# EAGLE schematic vm_mini_exp5 (EAGLE 6.4)

## Sheet 1 of 3
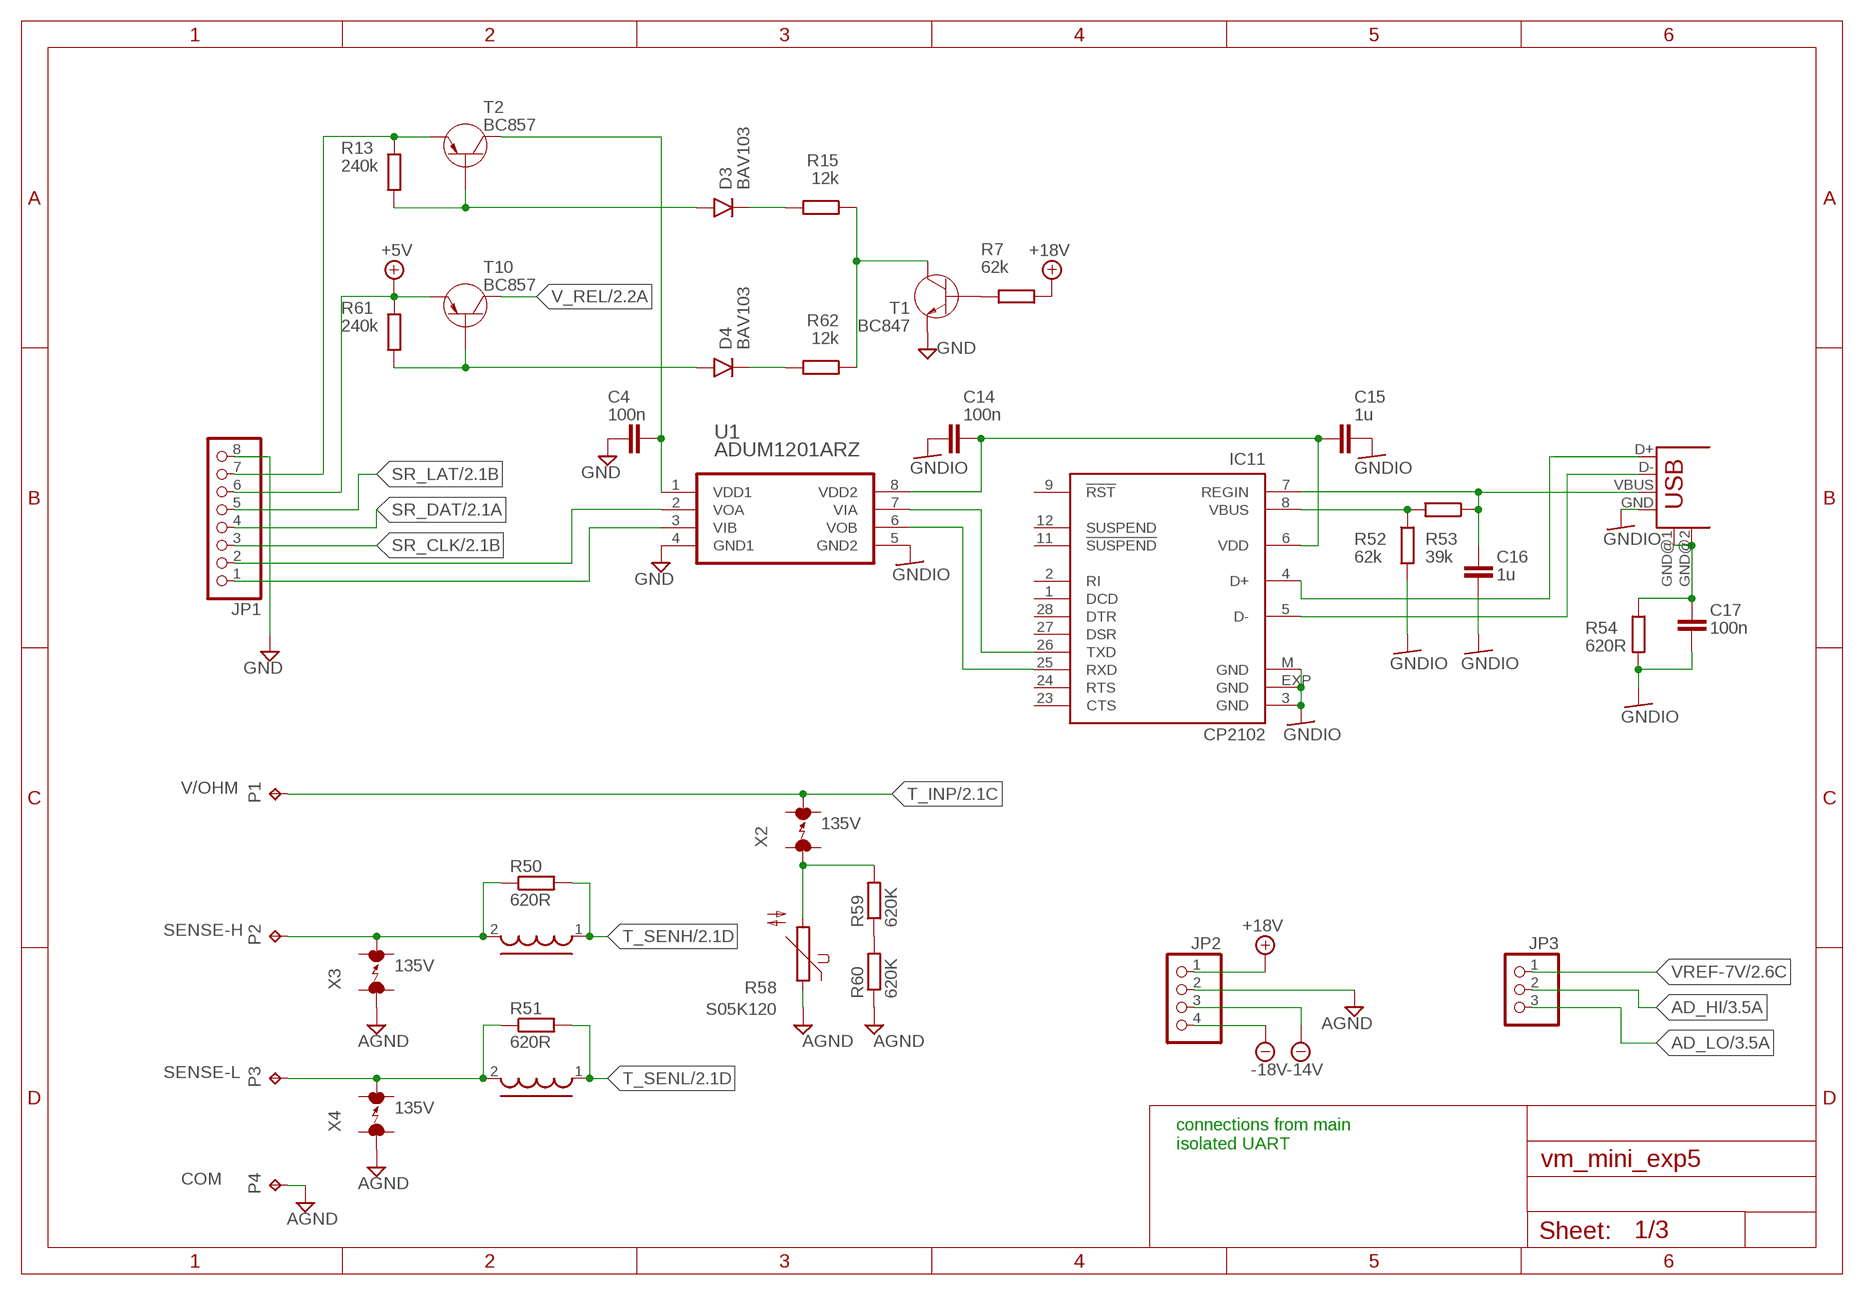
[diagram p0: schematic, sheet 1]

### Parts
C4  100n  C_0806  [R0805]
C14  100n  C_0806  [R0805]
C15  1u  C_0806  [R0805]
C16  1u  C_0806  [R0805]
C17  100n  C_0806  [R0805]
D3  BAV103  1N4148SOD  [SOD-80]
D4  BAV103  1N4148SOD  [SOD-80]
IC11  CP2102  [MLP28]
JP1  PINHD-1X08_2.54  [1X08]
JP2  PINHD-1X04_2.54  [1X04]
JP3  PINHD-1X03_2.54  [1X03]
P1  TPPAD1-17  [P1-17]
P2  TPPAD1-17  [P1-17]
P3  TPPAD1-17  [P1-17]
P4  TPPAD1-17  [P1-17]
R7  62k  RMMELF  [R_MINIMELF]
R13  240k  RMMELF  [R_MINIMELF]
R15  12k  RMMELF  [R_MINIMELF]
R50  620R  RMMELF  [R_MINIMELF]
R51  620R  RMMELF  [R_MINIMELF]
R52  62k  RMMELF  [R_MINIMELF]
R53  39k  RMMELF  [R_MINIMELF]
R54  620R  RMMELF  [R_MINIMELF]
R58  S05K120  S05K175  [S05K175]
R59  620K  RMMELF  [R_MINIMELF]
R60  620K  RMMELF  [R_MINIMELF]
R61  240k  RMMELF  [R_MINIMELF]
R62  12k  RMMELF  [R_MINIMELF]
T1  BC847  [SOT23]
T2  BC857  [SOT23]
T10  BC857  [SOT23]
U1  ADUM1201ARZ  [SOIC127P600X175-8N]
U$7  INDUCTOR_GEN1210  [1210]
U$8  INDUCTOR_GEN1210  [1210]
USB1  USB-B-H  [USB-B-H]
X2  135V  ARRESTER  [EPCOS_N81]
X3  135V  ARRESTER  [EPCOS_N81]
X4  135V  ARRESTER  [EPCOS_N81]

### Nets
+5V: JP1.6 R61.P$1 T10.2(C) ; also sheet 2
+18V: JP2.1 R7.P$2 ; also sheet 2,3
-14V: JP2.3 ; also sheet 2,3
-18V: JP2.4 ; also sheet 2
AD_HI: JP3.2 ; also sheet 3
AD_LO: JP3.3 ; also sheet 3
AGND: JP2.2 P4.TP R58.1 R60.P$1 X3.1 X4.1 ; also sheet 2,3
GND: C4.1 JP1.8 T1.2(E) U1.4(GND1) ; also sheet 2
GNDIO: C14.1 C15.2 C16.1 C17.1 IC11.3(GND) IC11.EXP(GND) IC11.M(GND) R52.P$2 R54.P$2 U1.5(GND2) USB1.GND
N$1: JP1.1 U1.3(VIB)
N$2: JP1.2 U1.2(VOA)
N$3: IC11.4(D+) USB1.D+
N$4: IC11.5(D-) USB1.D-
N$5: C16.2 IC11.7(REGIN) R53.P$1 USB1.VBUS
N$39: R58.2 R59.P$2 X2.1
N$50: IC11.26(TXD) U1.7(VIA)
N$51: IC11.25(RXD) U1.6(VOB)
N$52: C14.2 C15.1 IC11.6(VDD) U1.8(VDD2)
N$53: IC11.8(VBUS) R52.P$1 R53.P$2
N$56: C17.2 R54.P$1 USB1.GND@1(GND) USB1.GND@2(GND)
N$57: R15.P$1 R62.P$1 T1.3(C)
N$61: D3.A R13.P$2 T2.1(B)
N$62: D4.K R62.P$2
N$64: R7.P$1 T1.1(B)
N$66: R59.P$1 R60.P$2
N$98: P3.TP R51.P$1 U$8.2 X4.2
N$99: P2.TP R50.P$1 U$7.2 X3.2
N$102: JP1.7 R13.P$1 T2.2(C)
N$103: D4.A R61.P$2 T10.1(B)
N$106: C4.2 T2.3(E) U1.1(VDD1)
N$107: D3.K R15.P$2
SR_CLK: JP1.3 ; also sheet 2
SR_DAT: JP1.4 ; also sheet 2
SR_LAT: JP1.5 ; also sheet 2
T_INP: P1.TP X2.2 ; also sheet 2
T_SENH: R50.P$2 U$7.1 ; also sheet 2
T_SENL: R51.P$2 U$8.1 ; also sheet 2
V_REL: T10.3(E) ; also sheet 2
VREF-7V: JP3.1 ; also sheet 2,3
Unconnected: IC11.1(DCD) IC11.2(RI) IC11.9(!RST) IC11.11(!SUSPEND) IC11.12(SUSPEND) IC11.23(CTS) IC11.24(RTS) IC11.27(DSR) IC11.28(DTR)

### Notes on the sheet
- V/OHM
- SENSE-H
- SENSE-L
- connections from main
  isolated UART
- COM

## Sheet 2 of 3
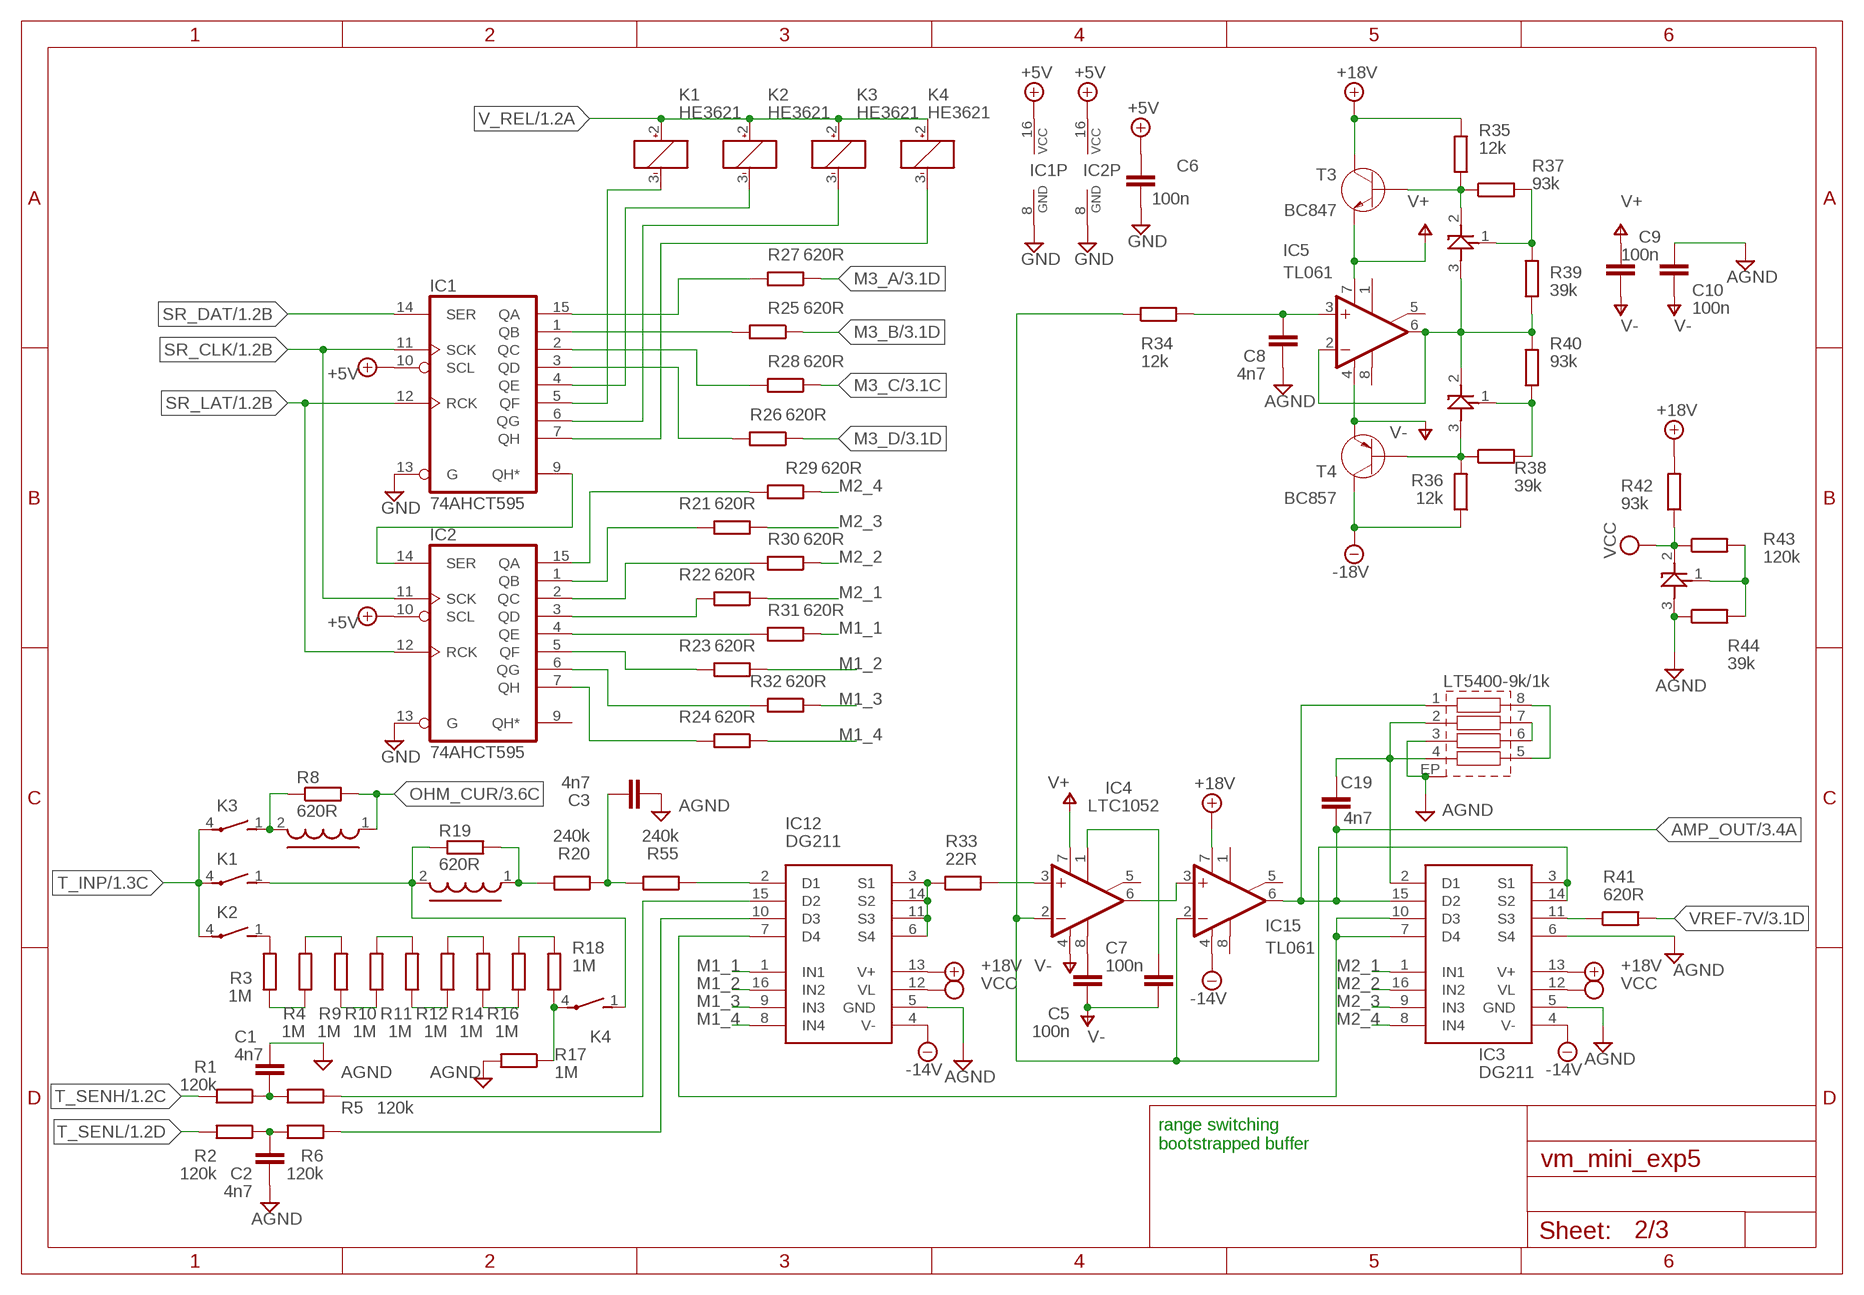
[diagram p1: schematic, sheet 2]

### Parts
C1  4n7  C-EU050-025X075  [C050-025X075]
C2  4n7  C-EU050-025X075  [C050-025X075]
C3  4n7  C-EU050-025X075  [C050-025X075]
C5  100n  C-EU050-045X075  [C050-045X075]
C6  100n  C_0806  [R0805]
C7  100n  C-EU050-045X075  [C050-045X075]
C8  4n7  C-EU050-025X075  [C050-025X075]
C9  100n  C_0806  [R0805]
C10  100n  C_0806  [R0805]
C19  4n7  C-EU050-025X075  [C050-025X075]
IC1  74AHCT595  74HCT595D  [SO16]
IC2  74AHCT595  74HCT595D  [SO16]
IC3  DG211  [SO-16]
IC4  LTC1052  TL071P  [DIL08]
IC5  TL061  TL071D  [SO08]
IC6  TL431_SOT23  [SOT23]
IC12  DG211  [SO-16]
IC13  TL431_SOT23  [SOT23]
IC14  TL431_SOT23  [SOT23]
IC15  TL061  TL071D  [SO08]
K1  HE3621  [HE3621]
K2  HE3621  [HE3621]
K3  HE3621  [HE3621]
K4  HE3621  [HE3621]
R1  120k  RMMELF  [R_MINIMELF]
R2  120k  RMMELF  [R_MINIMELF]
R3  1M  RMMELF  [R_MINIMELF]
R4  1M  RMMELF  [R_MINIMELF]
R5  120k  RMMELF  [R_MINIMELF]
R6  120k  RMMELF  [R_MINIMELF]
R8  620R  RMMELF  [R_MINIMELF]
R9  1M  RMMELF  [R_MINIMELF]
R10  1M  RMMELF  [R_MINIMELF]
R11  1M  RMMELF  [R_MINIMELF]
R12  1M  RMMELF  [R_MINIMELF]
R14  1M  RMMELF  [R_MINIMELF]
R16  1M  RMMELF  [R_MINIMELF]
R17  1M  RMMELF  [R_MINIMELF]
R18  1M  RMMELF  [R_MINIMELF]
R19  620R  RMMELF  [R_MINIMELF]
R20  240k  RMMELF  [R_MINIMELF]
R21  620R  RMMELF  [R_MINIMELF]
R22  620R  RMMELF  [R_MINIMELF]
R23  620R  RMMELF  [R_MINIMELF]
R24  620R  RMMELF  [R_MINIMELF]
R25  620R  RMMELF  [R_MINIMELF]
R26  620R  RMMELF  [R_MINIMELF]
R27  620R  RMMELF  [R_MINIMELF]
R28  620R  RMMELF  [R_MINIMELF]
R29  620R  RMMELF  [R_MINIMELF]
R30  620R  RMMELF  [R_MINIMELF]
R31  620R  RMMELF  [R_MINIMELF]
R32  620R  RMMELF  [R_MINIMELF]
R33  22R  RMMELF  [R_MINIMELF]
R34  12k  RMMELF  [R_MINIMELF]
R35  12k  RMMELF  [R_MINIMELF]
R36  12k  RMMELF  [R_MINIMELF]
R37  93k  RMMELF  [R_MINIMELF]
R38  39k  RMMELF  [R_MINIMELF]
R39  39k  RMMELF  [R_MINIMELF]
R40  93k  RMMELF  [R_MINIMELF]
R41  620R  RMMELF  [R_MINIMELF]
R42  93k  RMMELF  [R_MINIMELF]
R43  120k  RMMELF  [R_MINIMELF]
R44  39k  RMMELF  [R_MINIMELF]
R55  240k  RMMELF  [R_MINIMELF]
RN3  LT5400  [MSOP8-EP]
T3  BC847  [SOT23]
T4  BC857  [SOT23]
U$1  INDUCTOR_GEN1210  [1210]
U$2  INDUCTOR_GEN1210  [1210]

### Nets
+5V: C6.1 IC1.10(SCL) IC1.16(VCC) IC2.10(SCL) IC2.16(VCC) ; also sheet 1
+18V: IC3.13(V+) IC12.13(V+) IC15.7(V+) R35.P$2 R42.P$2 T3.3(C) ; also sheet 1,3
-14V: IC3.4(V-) IC12.4(V-) IC15.4(V-) ; also sheet 1,3
-18V: R36.P$1 T4.3(E) ; also sheet 1
AGND: C1.1 C2.1 C3.1 C8.1 C10.1 IC3.5(GND) IC3.6(S4) IC6.3(A) IC12.5(GND) R17.P$2 R44.P$1 RN3.3(R3A) RN3.EP(SH) ; also sheet 1,3
AGND1: IC14.3(A) R36.P$2 R38.P$1 T4.1(B)
AMP_OUT: C19.1 IC3.15(D2) IC15.6(OUT) RN3.1(R1A) ; also sheet 3
GND: C6.2 IC1.8(GND) IC1.13(G) IC2.8(GND) IC2.13(G) ; also sheet 1
M1_1: IC12.1(IN1) R31.P$1
M1_2: IC12.16(IN2) R23.P$1
M1_3: IC12.9(IN3) R32.P$1
M1_4: IC12.8(IN4) R24.P$1
M2_1: IC3.1(IN1) R22.P$1
M2_2: IC3.16(IN2) R30.P$1
M2_3: IC3.9(IN3) R21.P$1
M2_4: IC3.8(IN4) R29.P$1
M3_A: R27.P$1 ; also sheet 3
M3_B: R25.P$1 ; also sheet 3
M3_C: R28.P$1 ; also sheet 3
M3_D: R26.P$1 ; also sheet 3
N$6: IC3.7(D4) IC3.10(D3) IC12.7(D4)
N$7: RN3.5(R4B) RN3.8(R1B)
N$8: C19.2 IC3.2(D1) RN3.2(R2A) RN3.4(R4A)
N$9: RN3.6(R3B) RN3.7(R2B)
N$15: R3.P$1 R4.P$1
N$16: IC12.3(S1) IC12.6(S4) IC12.11(S3) IC12.14(S2) R33.P$1
N$17: R4.P$2 R9.P$2
N$18: R9.P$1 R10.P$1
N$19: R10.P$2 R11.P$2
N$20: R11.P$1 R12.P$1
N$21: R12.P$2 R14.P$2
N$22: R14.P$1 R16.P$1
N$23: R16.P$2 R18.P$2
N$24: K4.4(2:P) R17.P$1 R18.P$1
N$25: K2.1(2:S) R3.P$2
N$26: IC1.5(QF) K1.3(1:-)
N$27: R19.P$2 R20.P$2 U$2.1
N$28: IC1.4(QE) K2.3(1:-)
N$29: IC1.6(QG) K3.3(1:-)
N$30: C3.2 R20.P$1 R55.P$2
N$31: IC4.3(+IN) R33.P$2
N$32: IC1.7(QH) K4.3(1:-)
N$33: C1.2 R1.P$1 R5.P$2
N$34: IC5.2(-IN) IC5.6(OUT) IC13.3(A) IC14.2(C) R39.P$1 R40.P$1
N$35: C5.2 IC4.8(OPT)
N$36: C7.2 IC4.1(ON1)
N$37: C2.2 R2.P$1 R6.P$2
N$38: IC12.15(D2) R5.P$1
N$40: C8.2 IC5.3(+IN) R34.P$2
N$41: IC12.10(D3) R6.P$1
N$44: IC1.9(QH*) IC2.14(SER)
N$46: IC1.15(QA) R27.P$2
N$47: IC1.1(QB) R25.P$2
N$48: IC1.2(QC) R28.P$2
N$49: IC1.3(QD) R26.P$2
N$54: IC2.15(QA) R29.P$2
N$55: IC2.1(QB) R21.P$2
N$58: IC3.3(S1) IC3.14(S2) IC4.2(-IN) IC15.2(-IN) R34.P$1
N$59: IC2.2(QC) R30.P$2
N$60: IC2.3(QD) R22.P$2
N$63: IC2.4(QE) R31.P$2
N$65: IC12.2(D1) R55.P$1
N$67: IC3.11(S3) R41.P$1
N$68: IC2.7(QH) R24.P$2
N$69: IC2.6(QG) R32.P$2
N$70: IC2.5(QF) R23.P$2
N$82: IC13.2(C) R35.P$1 R37.P$1 T3.1(B)
N$83: IC13.1(R) R37.P$2 R39.P$2
N$91: IC6.1(R) R43.P$2 R44.P$2
N$92: IC14.1(R) R38.P$2 R40.P$2
N$100: K1.1(2:S) K4.1(2:S) R19.P$1 U$2.2
N$101: K3.1(2:S) R8.P$1 U$1.2
N$104: IC4.6(OUT) IC15.3(+IN)
OHM_CUR: R8.P$2 U$1.1 ; also sheet 3
SR_CLK: IC1.11(SCK) IC2.11(SCK) ; also sheet 1
SR_DAT: IC1.14(SER) ; also sheet 1
SR_LAT: IC1.12(RCK) IC2.12(RCK) ; also sheet 1
T_INP: K1.4(2:P) K2.4(2:P) K3.4(2:P) ; also sheet 1
T_SENH: R1.P$2 ; also sheet 1
T_SENL: R2.P$2 ; also sheet 1
V+: C9.1 IC4.7(V+) IC5.7(V+) T3.2(E)
V-: C5.1 C7.1 C9.2 C10.2 IC4.4(V-) IC5.4(V-) T4.2(C)
V_REL: K1.2(1:+) K2.2(1:+) K3.2(1:+) K4.2(1:+) ; also sheet 1
VCC: IC3.12(VL) IC6.2(C) IC12.12(VL) R42.P$1 R43.P$1 ; also sheet 3
VREF-7V: R41.P$2 ; also sheet 1,3
Unconnected: IC2.9(QH*) IC4.5(ON2) IC5.1(ON1) IC5.5(ON2) IC5.8(OPT) IC15.1(ON1) IC15.5(ON2) IC15.8(OPT)

### Notes on the sheet
- LT5400-9k/1k
- range switching
  bootstrapped buffer

## Sheet 3 of 3
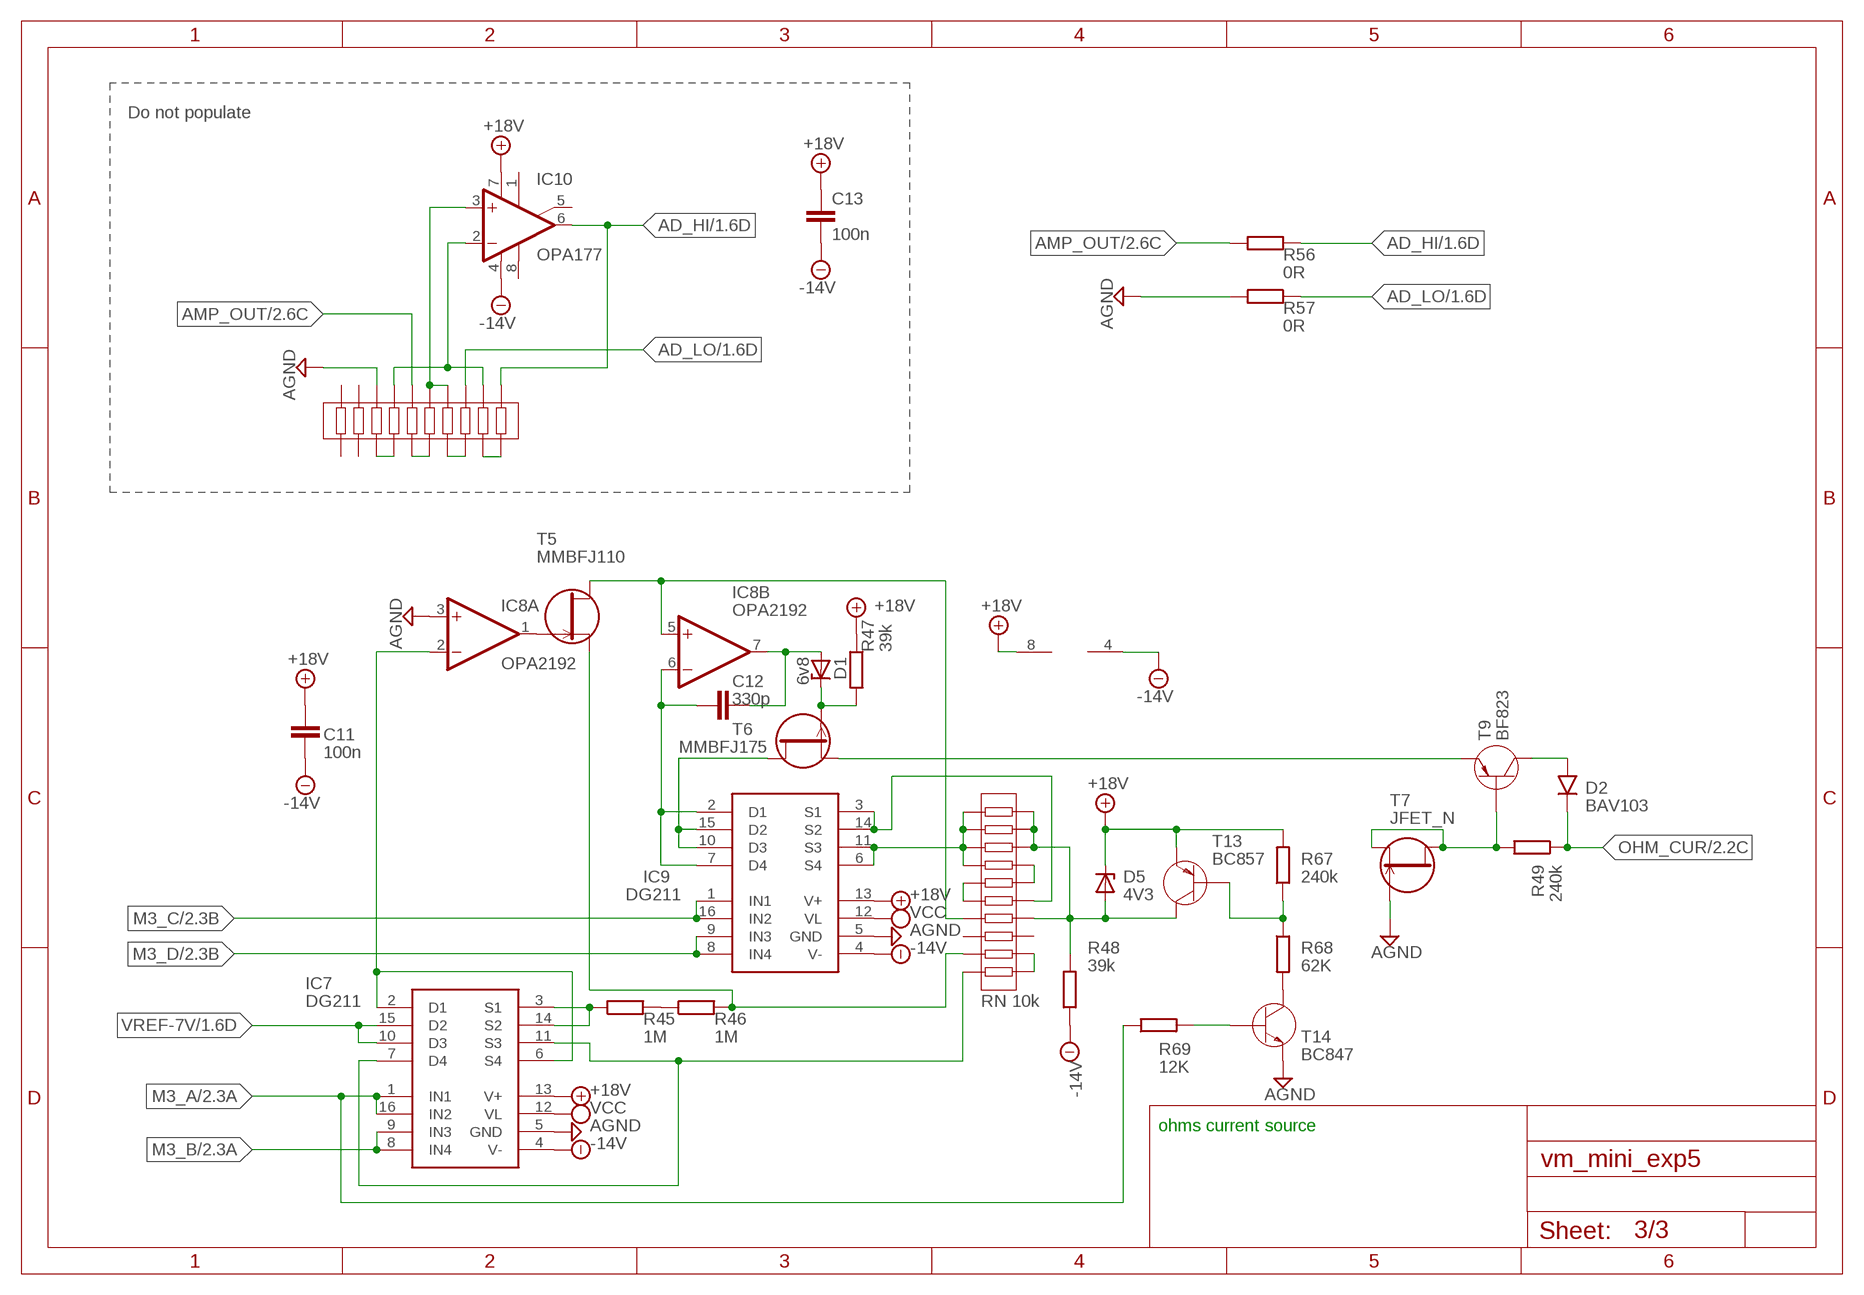
[diagram p2: schematic, sheet 3]

### Parts
C11  100n  C_0806  [R0805]
C12  330p  CMM  [R_MINIMELF]
C13  100n  C_0806  [R0805]
D1  6v8  ZENER-DIODESOD80C  [SOD80C]
D2  BAV103  1N4148SOD  [SOD-80]
D5  4V3  ZENER-DIODESOD80C  [SOD80C]
IC7  DG211  [SO-16]
IC8  OPA2192  TL072D  [SO08]
IC9  DG211  [SO-16]
IC10  OPA177  TL071D  [SO08]
R45  1M  RMMELF  [R_MINIMELF]
R46  1M  RMMELF  [R_MINIMELF]
R47  39k  RMMELF  [R_MINIMELF]
R48  39k  RMMELF  [R_MINIMELF]
R49  240k  RMMELF  [R_MINIMELF]
R56  0R  RMMELF  [R_MINIMELF]
R57  0R  RMMELF  [R_MINIMELF]
R67  240k  RMMELF  [R_MINIMELF]
R68  62K  RMMELF  [R_MINIMELF]
R69  12K  RMMELF  [R_MINIMELF]
RN1  OSOP20  [OSOP20]
RN2  OSOP20  [OSOP20]
T5  MMBFJ110  JFET_N  [SOT23]
T6  MMBFJ175  JFET_P  [SOT23]
T7  JFET_N  [SOT23]
T9  BF823  BC857  [SOT23]
T13  BC857  [SOT23]
T14  BC847  [SOT23]

### Nets
+18V: C11.1 C13.1 D5.C IC7.13(V+) IC8.8(P:V+) IC9.13(V+) IC10.7(V+) R47.P$1 R67.P$2 T13.2(C) ; also sheet 1,2
-14V: C11.2 C13.2 IC7.4(V-) IC8.4(P:V-) IC9.4(V-) IC10.4(V-) R48.P$1 ; also sheet 1,2
AD_HI: IC10.6(OUT) R56.P$1 RN1.1(1A) ; also sheet 1
AD_LO: R57.P$1 RN1.3(3A) ; also sheet 1
AGND: IC7.5(GND) IC8.3(A:+IN) IC9.5(GND) R57.P$2 RN1.8(8A) T7.3(G) T14.2(E) ; also sheet 1,2
AMP_OUT: R56.P$2 RN1.6(6A) ; also sheet 2
M3_A: IC7.1(IN1) IC7.16(IN2) R69.P$1 ; also sheet 2
M3_B: IC7.8(IN4) IC7.9(IN3) ; also sheet 2
M3_C: IC9.1(IN1) IC9.16(IN2) ; also sheet 2
M3_D: IC9.8(IN4) IC9.9(IN3) ; also sheet 2
N$42: RN1.19(2B) RN1.20(1B)
N$43: IC8.5(B:+IN) RN2.7(7A) T5.1(D)
N$45: RN1.17(4B) RN1.18(3B)
N$71: RN2.5(5A) RN2.6(6A)
N$72: RN2.11(10B) RN2.12(9B)
N$73: IC9.3(S1) IC9.14(S2) RN2.15(6B)
N$74: C12.P$1 IC8.6(B:-IN) IC9.2(D1) IC9.7(D4)
N$75: IC9.6(S4) IC9.11(S3) RN2.1(1A) RN2.2(2A) RN2.3(3A) RN2.4(4A)
N$76: IC7.3(S1) IC7.14(S2) R45.P$1
N$77: RN2.16(5B) RN2.17(4B)
N$78: IC8.1(A:OUT) T5.3(G)
N$79: R46.P$2 RN2.9(9A) T5.2(S)
N$80: IC9.10(D3) IC9.15(D2) T6.1(D)
N$81: IC7.7(D4) IC7.11(S3) RN2.10(10A)
N$84: C12.P$2 D1.A IC8.7(B:OUT)
N$85: R45.P$2 R46.P$1
N$86: D1.C R47.P$2 T6.3(G)
N$87: IC7.2(D1) IC7.6(S4) IC8.2(A:-IN)
N$88: R49.P$2 T7.1(D) T7.2(S) T9.1(B)
N$89: RN1.15(6B) RN1.16(5B)
N$90: RN1.13(8B) RN1.14(7B)
N$93: T6.2(S) T9.2(C)
N$94: D2.A T9.3(E)
N$95: IC10.3(+IN) RN1.4(4A) RN1.5(5A)
N$96: IC10.2(-IN) RN1.2(2A) RN1.7(7A)
N$108: D5.A R48.P$2 RN2.14(7B) RN2.18(3B) RN2.19(2B) RN2.20(1B) T13.3(E)
N$117: R67.P$1 R68.P$1 T13.1(B)
N$118: R68.P$2 T14.3(C)
N$119: R69.P$2 T14.1(B)
OHM_CUR: D2.K R49.P$1 ; also sheet 2
VCC: IC7.12(VL) IC9.12(VL) ; also sheet 2
VREF-7V: IC7.10(D3) IC7.15(D2) ; also sheet 1,2
Unconnected: IC10.1(ON1) IC10.5(ON2) IC10.8(OPT) RN1.9(9A) RN1.10(10A) RN1.11(10B) RN1.12(9B) RN2.8(8A) RN2.13(8B)

### Notes on the sheet
- Do not populate
- RN 10k
- ohms current source

## Library data of the parts
C1-C3 C5 C7 C8 C19 = _rcl:C-EU: CAPACITOR, European symbol
C4 C6 C9-C17 = _moja:C
D1 D5 = diode:ZENER-DIODE: Z-Diode
D2-D4 = _mcom6:1N4148
IC1 IC2 = 74xx-eu:74*595: 8-bit SHIFT REGISTER, output latch
IC3 IC7 IC9 IC12 = _mcom6:DG211
IC4 IC5 IC15 = _linear:TL071: OP AMP
IC6 IC13 IC14 = _mcom6:TL431
IC8 = _linear:TL072: OP AMP
IC10 = linear:TL071: OP AMP
IC11 = silabs:CP210*: Single-Chip USB to UART Bridge Source: www.silabs.com .. CP2101.pdf / cp2102.pdf; MF: FARNELL; MPN: CP2102-GM; OC_FARNELL: 9282130; OC_NEWARK: 30K5635
JP1 = pinhead-2:PINHD-1X08: PIN HEADER
JP2 = pinhead-2:PINHD-1X04: PIN HEADER
JP3 = pinhead-2:PINHD-1X03: PIN HEADER
K1-K4 = relay:HE3621: RELAY reed, 1 x norm. open, grid 5.08 mm, Hamlin
P1-P4 = testpad:TP: Test pad
R1-R57 R59-R62 R67-R69 = _moja:R
R58 = varistor:S05K175: VARISTOR
RN1 RN2 = _moja_e:OSOP20
RN3 = _mcom6:LT5400
T1 T3 T14 = _mcom6:BC847
T2 T4 T9 T10 T13 = _mcom6:BC857
T5 T7 = _mcom6:JFET_N
T6 = _mcom6:JFET_P
U1 = _mcom6:ADUM1201ARZ: Dual-Channel Digital Isolators; MPN: ADUM1201ARZ; OC_FARNELL: 1078200; OC_NEWARK: 19M0753; PACKAGE: SOIC-8; SUPPLIER: Analog Devices
U$1 U$2 U$7 U$8 = _moja:INDUCTOR_GEN
USB1 = con-usb-2:USB: USB Connectors
X2-X4 = discrete:ARRESTER: GASENTLADUNGSABLEITER 90V 10KA DC-Überschlag: 90V; Spannung, Impulsüberschlag: < 600V; Strom, Pulsentlastung, max.: 10kA Source: http://de.farnell.com .. 4025.pdf